# EAGLE design Čos - 5V0 converter (EAGLE 9.4.0)
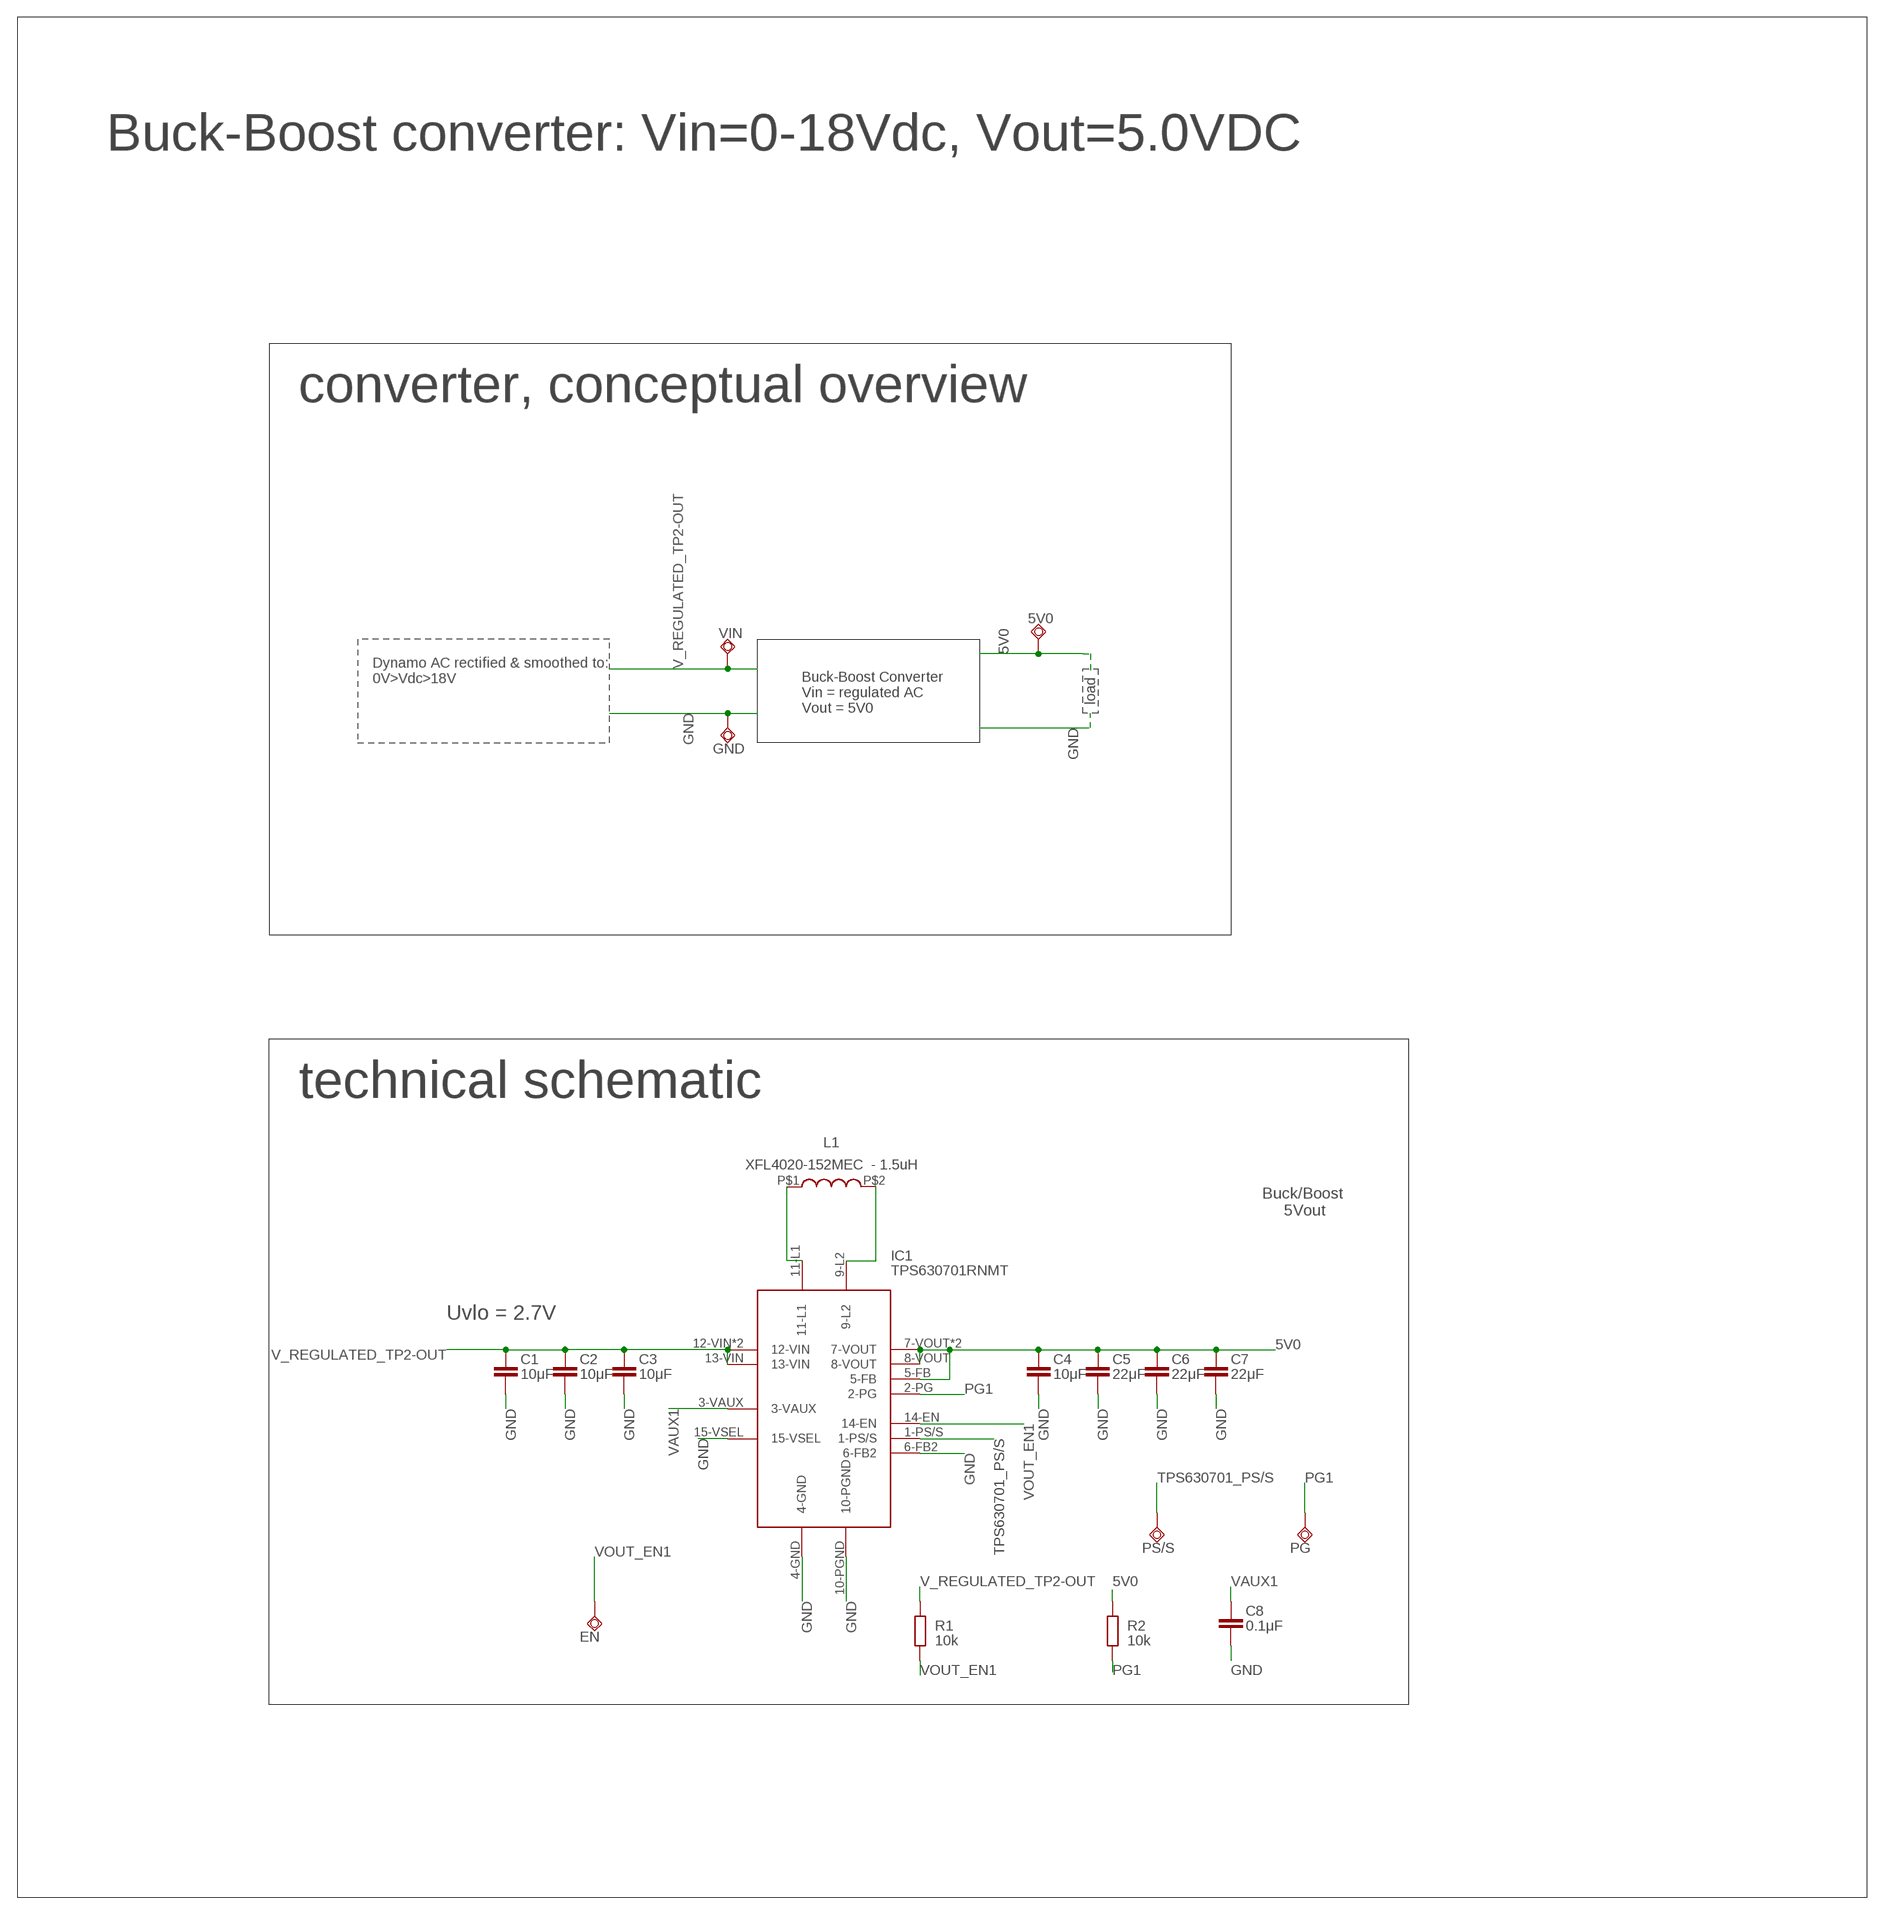
[diagram p0: schematic, sheet 1]

## Parts
5V0  TPSQPAD1-13  [P1-13]
C1  10μF  C-EUC0805  [C0805]
C2  10μF  C-EUC0805  [C0805]
C3  10μF  C-EUC0603  [C0603]
C4  10μF  C-EUC0603  [C0603]
C5  22μF  C-EUC0805  [C0805]
C6  22μF  C-EUC0805  [C0805]
C7  22μF  C-EUC0805  [C0805]
C8  0.1μF  C-EUC0402  [C0402]
EN  TPSQTP13R  [TP13R]
GND  TPSQPAD1-13  [P1-13]
IC1  TPS630701RNMT  TPS630701  [VQFN]
L1  XFL4020-152MEC - 1.5uH  XFL4020-152MEC  [SMD]
PG  TPSQTP13R  [TP13R]
PS/S  TPSQTP13R  [TP13R]
R1  10k  R-EU_R0402  [R0402]
R2  10k  R-EU_R0402  [R0402]
VIN  TPSQPAD1-13  [P1-13]

## Nets
5V0 [5V0]: 5V0.TP C4.1 C5.1 C6.1 C7.1 IC1.5-FB IC1.7-VOUT IC1.8-VOUT IC1.VOUT(7-VOUT) R2.2
GND [5V0]: C1.2 C2.2 C3.2 C4.2 C5.2 C6.2 C7.2 C8.2 GND.TP IC1.4-GND IC1.6-FB2 IC1.10-PGND IC1.15-VSEL
N$1 [5V0]: IC1.11-L1 L1.P$1
N$5 [5V0]: IC1.9-L2 L1.P$2
PG1 [5V0]: IC1.2-PG PG.TP R2.1
TPS630701_PS/S [signal]: IC1.1-PS/S PS/S.TP
V_REGULATED_TP2-OUT [5V0]: C1.1 C2.1 C3.1 IC1.12-VIN IC1.13-VIN IC1.VIN(12-VIN) R1.2 VIN.TP
VAUX1 [5V0]: C8.1 IC1.3-VAUX
VOUT_EN1 [5V0]: EN.TP IC1.14-EN R1.1

## Notes on the sheet
- Buck-Boost converter: Vin=0-18Vdc, Vout=5.0VDC
- converter, conceptual overview
- Dynamo AC rectified & smoothed to:
  0V>Vdc>18V
- load
- Buck-Boost Converter
  Vin = regulated AC
  Vout = 5V0
- technical schematic
- Buck/Boost 
  5Vout
- Uvlo = 2.7V

## Library data of the parts
5V0 EN GND PG PS/S VIN = testpad:TPSQ: Test pad
C1-C8 = rcl:C-EU: CAPACITOR, European symbol; SPICEPREFIX: C
IC1 = TPS630701 - Buck Boost 5V regulator:TPS630701
L1 = XFL4020-152MEC Inductor 1.5uH:XFL4020-152MEC
R1 R2 = rcl:R-EU_: RESISTOR, European symbol; SPICEPREFIX: R

## Net classes
0 GND: width 0.5 mm, drill 0.3 mm, clearance 0.2 mm
1 V_REGULATED: width 0.3 mm, drill 0.3 mm, clearance 0.2 mm
2 5V0: width 0.3 mm, drill 0.3 mm, clearance 0.2 mm
3 signal: width 0.3 mm, drill 0.3 mm, clearance 0.2 mm

## Board
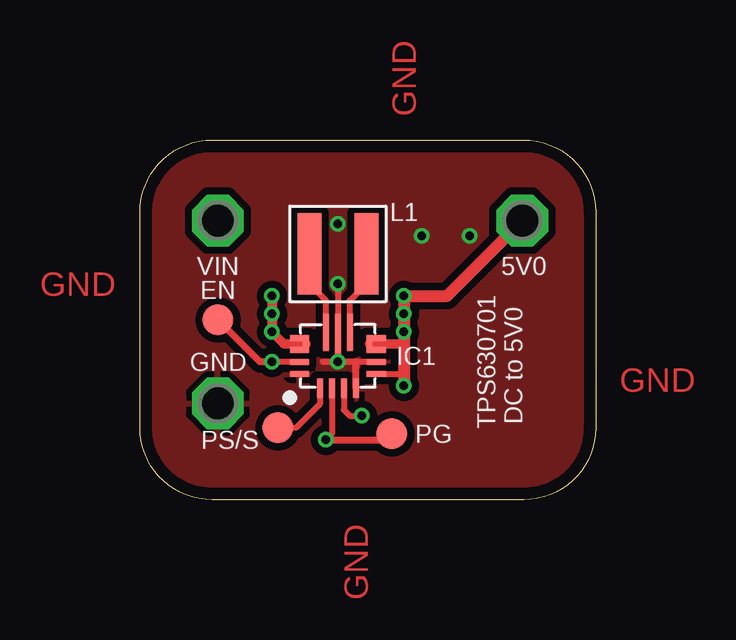
[diagram p1: board, top side]
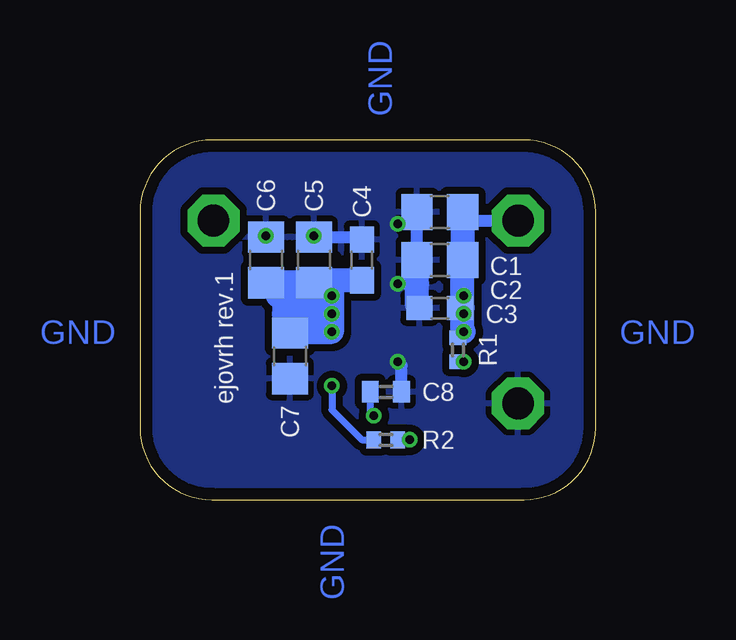
[diagram p2: board, bottom side, seen from below]

Size 19 x 15 mm. Coordinates in mm from the lower left corner, seen from the top.
Outline: 19,12 19,3 arc-90 16,0 3,0 arc-90 0,3 0,12 arc-90 3,15 16,15 arc-90 19,12
Copper layers (1*16): Top 0.035mm / dielectric 1.5mm / Bottom 0.035mm
Design rules "markovac_2layer": minimum track width 0.2mm, minimum drill 0.35mm, track to track 0.2mm, track to pad 0.2mm, pad to pad 0.2mm, via to via 0.2mm, smd to smd 0.2mm, copper to edge 0.5mm, drill to drill 8mil, minimum pad ring 0.15mm, minimum via ring 0.15mm, stop-mask expansion 4mil, vias tented up to drill 0.34mm, thermal gap 10mil
bRestrict: 1 lines

### Footprints (pad centres in the part's own frame; a part is rotated, then mirrored left to right if it is on the bottom)
P1-13 = drill 1.321 pad 2.159 octagon: TP 0,0
C0805 = smd 1.3 x 1.5: 1 -0.95,0; 2 0.95,0
C0603 = smd 1.1 x 1: 1 -0.85,0; 2 0.85,0
C0402 = smd 0.7 x 0.9: 1 -0.65,0; 2 0.65,0
TP13R = smd 1.3 x 1.3: TP 0,0
VQFN = smd 0.8 x 0.25: 1-PS/S -1.35,0.75; 2-PG -1.35,0.25; 3-VAUX -1.35,-0.25; 4-GND -1.35,-0.75 | smd 0.25 x 0.8: 5-FB -0.75,-1.6; 6-FB2 -0.25,-1.6; 7-VOUT 0.25,-1.6; 8-VOUT 0.75,-1.6; 12-VIN 0.75,1.6; 13-VIN 0.25,1.6; 14-EN -0.25,1.6; 15-VSEL -0.75,1.6 | smd 1.55 x 0.25: 9-L2 0.99,-0.5; 11-L1 0.99,0.5 | smd 1.9 x 0.25: 10-PGND 0.815,0 | smd 0.6 x 0.25: VIN 0.5,1.325; VOUT 0.505,-1.325
SMD = smd 1 x 3.4: P$1 -1.185,0; P$2 1.185,0
R0402 = smd 0.6 x 0.7: 1 -0.5,0; 2 0.5,0

### Placement (x,y rotation side)
5V0  15.94,11.64 0 top
C1  6.5,12 180 bottom
C2  6.5,10 180 bottom
C3  6.5,8 180 bottom
C4  9.75,10 90 bottom
C5  11.75,10 90 bottom
C6  13.75,10 90 bottom
C7  12.75,6 270 bottom
C8  8.75,4.5 0 bottom
EN  3.25,7.5 0 top
GND  3.24,4.02 0 top
IC1  8.25,6 90 top
L1  8.25,10.25 0 top
PG  10.5,2.75 0 top
PS/S  5.75,3 0 top
R1  5.75,6.25 90 bottom
R2  8.75,2.5 180 bottom
VIN  3.24,11.64 0 top

### Tracks (layer width: path | path; a pad name or v marks a point on that pad's centre or on a via)
5V0  (via drill 0.35)
  Top 0.25: v11,4.75 11,5.25 IC1.5-FB | IC1.7-VOUT 10.07,6.48 10.07,6.51 IC1.VOUT 10.09,6.51 IC1.8-VOUT
  Top 0.4: IC1.VOUT 11,6.51 v11,7
  Top 0.5: v11,8.51 v11,7 v11,4.75 | v11,8.5 12.8,8.5 5V0.TP
  Bottom 0.3: v11,4.75 11,3.75 9.75,2.5 R2.2
  Bottom 1: C5.1 C6.1 13,9.05 13,7.75 | C4.1 11,9.15 v11,8.5 | v11,8.5 v11,7 12.75,7 | 13.25,8.5 v11,8.5 | v11,7.75 13,7.75 | C7.1 12.75,7 | 12.75,7 13,7 13,7.75
GND  (via drill 0.35)
  Top 0.25: v8.25,5.75 IC1.10-PGND v8.25,9
  Top 0.254: IC1.6-FB2 9,5.75 v8.25,5.75 7.62,5.75
  Top 0.3: IC1.4-GND 9,5.75
  Bottom 0.5: C8.2 8.1,5.6 v8.25,5.75 | C2.2 C1.2 7.95,11.5 v8.25,11.5 | C4.2 9.85,10.95 C5.2 | C7.2 13.2,5.05 13.25,5 | 7.45,9 v8.25,9
  Bottom 1: C3.2 7.45,8.1 7.45,9 C2.2
  other vias: 11.75,11 13.75,11
  pour Top (isolate 0.3): 0,15 19,15 19,0 0,0
  pour Bottom (isolate 0.3): 0,15 19,15 19,0 0,0
N$1
  Top 0.254: IC1.11-L1 7.75,8.31 7.16,8.91
  Top 0.3: L1.P$1 7.07,8.91 7.16,8.91
N$5
  Top 0.254: IC1.9-L2 8.75,8.31 9.43,9
  Top 0.3: L1.P$2 9.43,9
PG1  (via drill 0.35)
  Top 0.25: IC1.2-PG 8,2.75 v7.75,2.5
  Top 0.3: v7.75,2.5 10.25,2.5 PG.TP
  Bottom 0.4: R2.1 v7.75,2.5
TPS630701_PS/S
  Top 0.25: IC1.1-PS/S 7.5,4 6.5,3 PS/S.TP
V_REGULATED_TP2-OUT  (via drill 0.35)
  Top 0.25: IC1.13-VIN 6.93,6.25 IC1.VIN 6.93,6.75 IC1.12-VIN
  Top 0.4: v5.5,7 6,6.5 IC1.VIN
  Top 0.406: v5.5,8.5 v5.5,7
  Bottom 0.3: v5.5,7 R1.2
  Bottom 0.5: C1.1 5.19,11.64 VIN.TP | C3.1 5.5,7.85 v5.5,7.75
  Bottom 1: C1.1 C2.1 5.55,8 | C3.1 5.55,8 | v5.5,7 5.55,7 5.55,8
VAUX1  (via drill 0.35)
  Top 0.25: v9.25,3.5 8.75,3.5 8.5,3.75
  Top 0.254: IC1.3-VAUX 8.5,3.75
  Bottom 0.3: v9.25,3.5 9.4,3.65 C8.1
VOUT_EN1  (via drill 0.35)
  Top 0.254: IC1.14-EN v5.5,5.75
  Top 0.3: v5.5,5.75 5,5.75 EN.TP
  Bottom 0.3: R1.1 v5.5,5.75

### Text on the board
Top: GND | GND | GND | GND
Bottom: GND | GND | GND | GND
tPlace: TPS630701 / DC to 5V0
bPlace: ejovrh rev.1